# Altium schematic sheet MEMS.SchDoc: MEMS sensors and Quad-SPI
size A4; Date: Not used; ApprovedBy: Not used; CheckedBy: Not used; Author: Not used; CompanyName: STMicroelectronics; DrawnBy: Not used; Engineer: Not used; Organization: Not used; Address1: Not used; Address2: Not used; Address3: Not used; Address4: Not used; DocumentNumber: Not used; Revision: Not used; SheetNumber: 4; SheetTotal: 8; CurrentTime: Not used; CurrentDate: Not used; Time: Not used; DocumentFullPathAndName: Not used; DocumentName: Not used; ModifiedDate: Not used; ImagePath: Not used; ProjectName: Not used; Application_BuildNumber: Not used
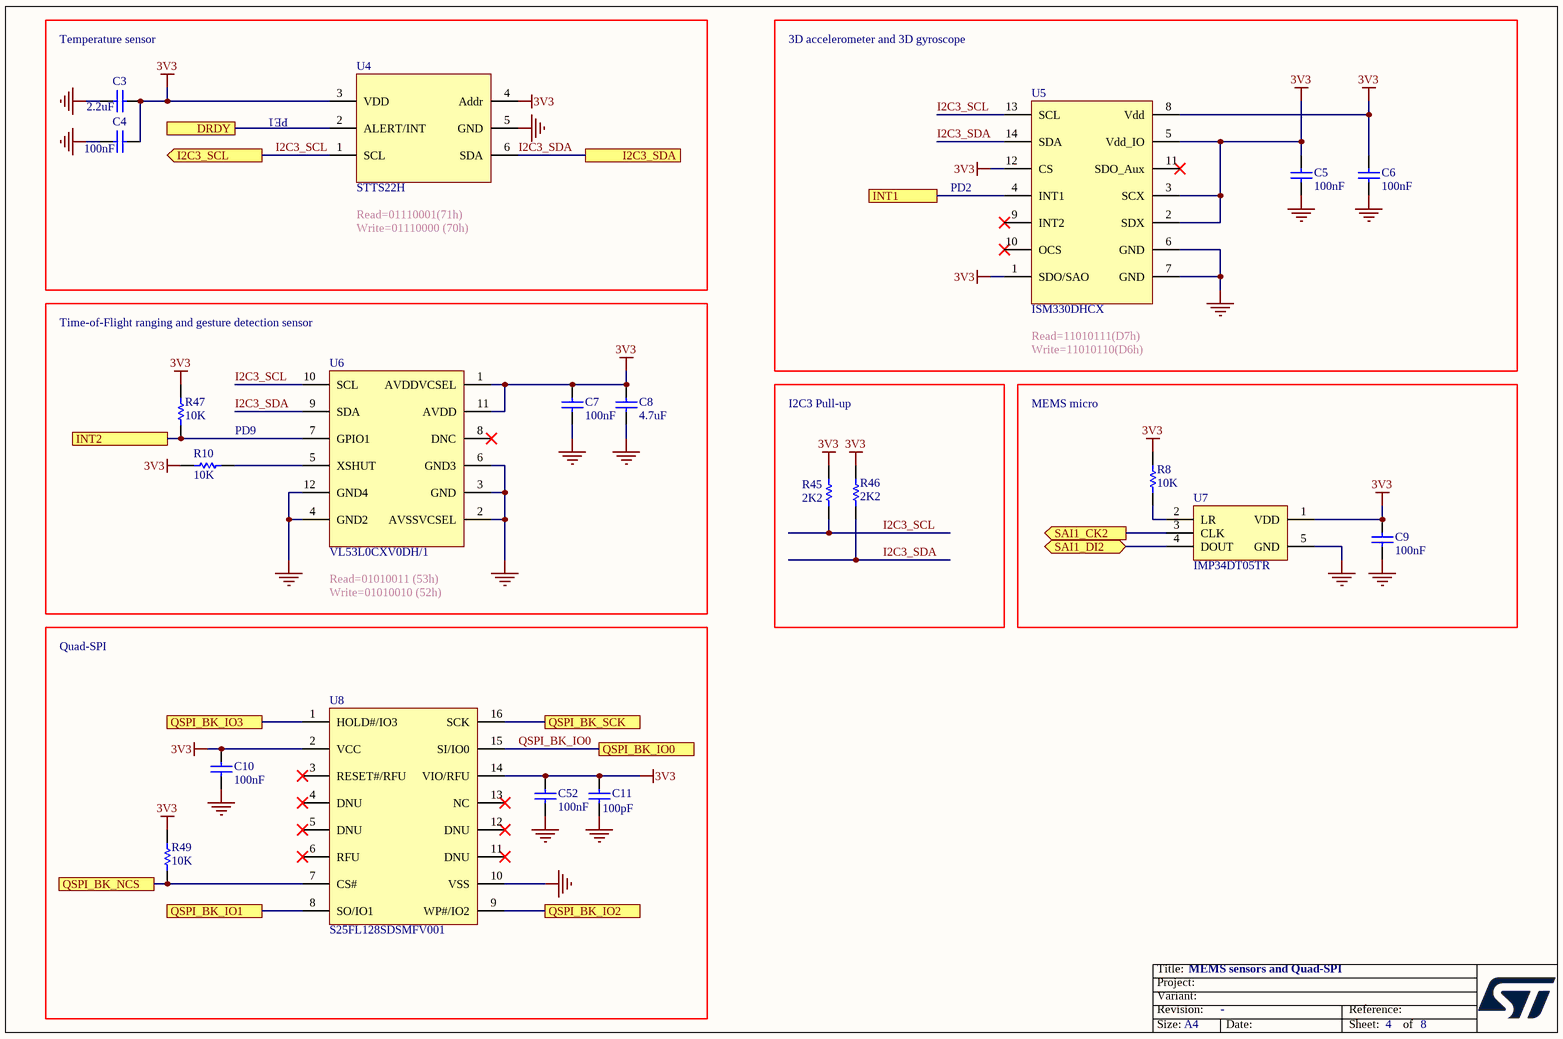
[diagram p0: MEMS.SchDoc]

## Parts
C3  value 2.2uF  [C0603_H0P8]  (hidden comment: Capacitor)
C4  value 100nF  [C0402]  (hidden comment: Capacitor)
C5  value 100nF  [C0402]  (hidden comment: Capacitor)
C6  value 100nF  [C0402]  (hidden comment: Capacitor)
C7  value 100nF  [C0402]  (hidden comment: Capacitor)
C8  value 4.7uF  [C0603]  (hidden comment: Capacitor)
C9  value 100nF  [C0402]  (hidden comment: Capacitor)
C10  value 100nF  [C0402]  (hidden comment: Capacitor)
C11  value 100pF  [C0603_H0P8]  (hidden comment: Capacitor)
C52  value 100nF  [C0402]  (hidden comment: Capacitor)
R8  value 10K  [R0402]  (hidden comment: Resistor)
R10  value 10K  [R0402]  (hidden comment: Resistor)
R45  value 2K2  [R0603]  (hidden comment: Resistor)
R46  value 2K2  [R0603]  (hidden comment: Resistor)
R47  value 10K  [R0402]  (hidden comment: Resistor)
R49  value 10K  [R0402]  (hidden comment: Resistor)
U4  STTS22H  [ICC_UDFN6-EPAD_2X2_P065]
U5  ISM330DHCX  [ICC_LGA14_3X2P5_P050]
U6  VL53L0CXV0DH/1  [OPT_TOF_ST_VL53L0X_LGA12_4P4X2P4_P080]
U7  IMP34DT05TR  [MIC_HCLGA_3X4X1_4LD]
U8  S25FL128SDSMFV001  [ICC_SOIC16_10P30X7P50_P127_H2P65]

## Blocks framed on the sheet
I2C3 Pull-up: R45 R46
MEMS micro: C9 R8 U7
Quad-SPI: C10 C11 C52 R49 U8

## Ports
DRDY, I2C3_SCL (out), I2C3_SDA, INT1, INT2, QSPI_BK_IO0, QSPI_BK_IO1, QSPI_BK_IO2, QSPI_BK_IO3, QSPI_BK_NCS, QSPI_BK_SCK, SAI1_CK2 (out), SAI1_DI2 (bidir)

## Nets
3V3: C3.2 C4.2 C5.2 C6.2 C7.2 C8.2 C9.2 C10.2 C11.2 C52.2 R8.2 R10.1 R45.2 R46.2 R47.2 R49.2 U4.3(VDD) U4.4(Addr) U5.1(SDO/SAO) U5.2(SDX) U5.3(SCX) U5.5(Vdd_IO) U5.8(Vdd) U5.12(CS) U6.1(AVDDVCSEL) U6.11(AVDD) U7.1(VDD) U8.2(VCC) U8.14(VIO/RFU)
GND: C3.1 C4.1 C5.1 C6.1 C7.1 C8.1 C9.1 C10.1 C11.1 C52.1 U4.5(GND) U5.6(GND) U5.7(GND) U6.2(AVSSVCSEL) U6.3(GND) U6.4(GND2) U6.6(GND3) U6.12(GND4) U7.5(GND) U8.10(VSS)
DRDY: U4.2(ALERT/INT) ; port DRDY
I2C3_SCL: R45.1 U4.1(SCL) U5.13(SCL) U6.10(SCL) ; port I2C3_SCL
I2C3_SDA: R46.1 U4.6(SDA) U5.14(SDA) U6.9(SDA) ; port I2C3_SDA
INT1: U5.4(INT1) ; port INT1
INT2: R47.1 U6.7(GPIO1) ; port INT2
QSPI_BK_IO0: U8.15(SI/IO0) ; port QSPI_BK_IO0
QSPI_BK_IO1: U8.8(SO/IO1) ; port QSPI_BK_IO1
QSPI_BK_IO2: U8.9(WP#/IO2) ; port QSPI_BK_IO2
QSPI_BK_IO3: U8.1(HOLD#/IO3) ; port QSPI_BK_IO3
QSPI_BK_NCS: R49.1 U8.7(CS#) ; port QSPI_BK_NCS
QSPI_BK_SCK: U8.16(SCK) ; port QSPI_BK_SCK
SAI1_CK2: U7.3(CLK) ; port SAI1_CK2
SAI1_DI2: U7.4(DOUT) ; port SAI1_DI2
NetR8_1: R8.1 U7.2(LR)
NetR10_2: R10.2 U6.5(XSHUT)

Not connected (* = marked no-connect by the designer): U5 9(INT2)* 10(OCS)* 11(SDO_Aux)*; U6 8(DNC)*; U8 3(RESET#/RFU)* 4(DNU)* 5(DNU)* 6(RFU)* 11(DNU)* 12(DNU)* 13(NC)*

## Notes on the sheet
- Temperature sensor
- 3D accelerometer and 3D gyroscope
- PE1
- Read=01110001(71h)
- Write=01110000 (70h)
- PD2
- Time-of-Flight ranging and gesture detection sensor
- Read=11010111(D7h)
- Write=11010110(D6h)
- (near R10) PD9
- Read=01010011 (53h)
- Write=01010010 (52h)
- Title:
- Project:
- Size:
- Revision:
- Variant:
- A4
- -
- Date:
- Reference:
- Sheet:
- of

## Library data of the parts
C3 = MCD-01540: Capacitor,MLCC, 2.2uF, 50V, X5R, +/-15%, 0603,T=0.8mm; Manufacturer_Part_Number: GRM188R61H225KE11; Manufacturer: MURATA; Part_Preference: Recommended; Order_Code_RS: 884-7289; Internal_Part_Number: MCD-01540; Status: Checked; Part_Type: Capacitor; Package: C0603; ComponentLink1URL: http://tunmcdsvn.tun.st.com/Component_Datasheet_Library/Trunk/Capacitors/Murata_Capacitor_GR_series/GRM188R61H225KE11#.pdf; Alternate_Manufacturer: N/A; Alternate_Manufacturer_Part_Number: N/A; Order_Code_Digikey: 490-10733-1-ND; Order_Code_Farnell: 2611925
C4-C7 C9 C10 C52 = MCD-00006: Capacitor, MLCC, 100nF, 16V, X7R, +/-10%, 0402, T=0.5mm; Manufacturer_Part_Number: CC0402KRX7R7BB104; Manufacturer: YAGEO; Alternate_Manufacturer_Part_Number: GCM155R71C104KA55D; Alternate_Manufacturer: MURATA; Part_Preference: Recommended; Order_Code_RS: 616-9701; Internal_Part_Number: MCD-00006; Status: Released; Part_Type: Capacitor; Package: C0402; ComponentLink1URL: http://tunmcdsvn.tun.st.com/Component_Datasheet_Library/Trunk/Capacitors/Yageo_Multilayer_Capacitor_X7R_series_100pF_to_22uF; Order_Code_Digikey: 311-1338-1-ND; Order_Code_Farnell: 9402047
C8 = MCD-00009: Capacitor, MLCC, 4.7uF, 16V, X5R, +/-10%, 0603, T=0.8mm; Manufacturer_Part_Number: CC0603KRX5R7BB475; Manufacturer: YAGEO; Part_Preference: Recommended; Internal_Part_Number: MCD-00009; Status: Released; Part_Type: Capacitor; Package: C0603; ComponentLink1URL: http://tunmcdsvn.tun.st.com/Component_Datasheet_Library/Trunk/Capacitors/Yageo_Multilayer_capacitor_X5R_series_100pF_to_100uF; Order_Code_Digikey: 311-1785-1-ND; Order_Code_Farnell: N/A; Order_Code_RS: N/A
C11 = MCD-01648: Capacitor,MLCC,100pF 50V,NPO,+/-5%, 0603,T=0,8mm; Manufacturer_Part_Number: CC0603JRNPO9BN101; Manufacturer: YAGEO; Part_Preference: Recommended; Order_Code_RS: 625-0267; Internal_Part_Number: MCD-01648; Status: Released; Part_Type: Capacitor; Package: C0603; ComponentLink1URL: http://tunmcdsvn.tun.st.com/Component_Datasheet_Library/Trunk/Capacitors/Yageo_UPY-GP_NP0_16V-to-50V/YAGEO_NP0_UPY-GP_NP0_16V-to-50V_16.pdf; Order_Code_Digikey: 311-1069-1-ND; Order_Code_Farnell: 722080
R8 R10 R47 R49 = MCD-00053: Resistor,10K,0402,1%,1/16W; Manufacturer_Part_Number: RC0402FR-0710KL; Manufacturer: YAGEO; BMS_Part_Number: 9131590; Part_Preference: Recommended; Internal_Part_Number: MCD-00053; Status: Released; Part_Type: Resistor; Package: R0402; ComponentLink1URL: http://tunmcdsvn.tun.st.com/Component_Datasheet_Library/Trunk/Resistors/Yageo_Resistor_RC0402-series; Order_Code_Digikey: 311-10.0KLRCT-ND; Order_Code_Farnell: 9239359; Order_Code_RS: N/A
R45 R46 = MCD-00349: Resistor,2K2,0603,1%,1/10W; Part_Preference: Recommended; Manufacturer: YAGEO; Manufacturer_Part_Number: RC0603FR-072K2L; Internal_Part_Number: MCD-00349; Status: Released; Part_Type: Resistor; Package: R0603; ComponentLink1URL: http://tunmcdsvn.tun.st.com/Component_Datasheet_Library/Trunk/Resistors/Yageo_Resistor_RC0603-series; Order_Code_Digikey: 311-2.20KHRCT-ND; Order_Code_Farnell: 9238522; Order_Code_RS: N/A
U4 = MCD-02159: temperature sensor; Part_Type: IC; Manufacturer: STMICROELECTRONICS; Part_Preference: Recommended; Manufacturer_HQ_COO: EU; Order_code_RS: 194-7646; Component_Country_Of_Origin: Thailand; Value: STTS22H; Order_code_Digikey: 497-STTS22HTR-ND; Order_code_Farnell: 3265386; Status: Checked; ComponentLink1URL: http://tunmcdsvn.tun.st.com/Component_Datasheet_Library/Trunk/IC/STM_MEMS_STTS22H; Internal_Part_Number: MCD-02159; Manufacturer_Part_Number: STTS22H; Alternate_Manufacturer_Part_Number: N/A; Alternate_Manufacturer: N/A; Package: UDFN 6-pins 2x2x0.5mm
U5 = MCD-02160: iNEMO inertial module: 3D accelerometer and 3D gyroscope, with digital output for industrial applications; Part_Type: IC; Manufacturer: STMICROELECTRONICS; Part_Preference: Recommended; Manufacturer_HQ_COO: EU; Order_code_RS: ISM330DHCXTR; Component_Country_Of_Origin: Malta, Philippines; Value: ISM330DHCX; Order_code_Digikey: 497-19784-2-ND; Order_code_Farnell: 3262493; Status: Checked; ComponentLink1URL: http://tunmcdsvn.tun.st.com/Component_Datasheet_Library/Trunk/IC/STM_3D-Gyro-ACC_ISM330DHCX; Internal_Part_Number: MCD-02160; Manufacturer_Part_Number: ISM330DHCXTR; Alternate_Manufacturer_Part_Number: N/A; Alternate_Manufacturer: N/A; Package: LGA-14L
U6 = MCD-01730: Time-of-Flight ranging and gesture detection; Part_Type: IC; Manufacturer: STMICROELECTRONICS; BMS_Part_Number: 9188012; Part_Preference: Recommended; Manufacturer_HQ_COO: EU; Component_Country_Of_Origin: China; Internal_Part_Number: MCD-01730; Value: VL53L0CXV0DH/1; Status: New; Manufacturer_Part_Number: VL53L0CXV0DH/1; Package: Optical LGA12 with liner; ComponentLink1URL: http://tunmcdsvn.tun.st.com/Component_Datasheet_Library/Trunk/IC/STM_sensor_VL53L0CXV0DH/vl53l0x.pdf
U7 = MCD-01715: MEMS audio sensor omnidirectional digital microphone for industrial applications; Part_Type: IC; Manufacturer: STMICROELECTRONICS; BMS_Part_Number: 9177995; Part_Preference: Recommended; Manufacturer_HQ_COO: EU; Component_Country_Of_Origin: Philippines; Internal_Part_Number: MCD-01715; Value: IMP34DT05TR; Status: Released; Manufacturer_Part_Number: IMP34DT05TR; Package: HCLGA-4LD; ComponentLink1URL: http://tunmcdsvn.tun.st.com/Component_Datasheet_Library/Trunk/IC/STM_Digital-Microphone_IMP34DT05TR
U8 = MCD-02038: Quad SPI with SOIC package 16-pins; Part_Type: IC; Manufacturer: CYPRESS; Part_Preference: Recommended; Value: S25FL128SDSMFV001; Order_Code_Digikey: S25FL128SDSMFV001-ND; Order_Code_Farnell: N/A; Order_Code_RS: N/A; Status: Released; ComponentLink1URL: http://tunmcdsvn.tun.st.com/Component_Datasheet_Library/Trunk/IC/Cypress_128_Mbit_3V_S25FL128SDSMFV001; Internal_Part_Number: MCD-02038; Manufacturer_Part_Number: S25FL128SDSMFV001; Alternate_Manufacturer_Part_Number: N/A; Alternate_Manufacturer: N/A; Package: SOIC 16-pins